# EAGLE design glove5 (EAGLE 7.2.0)
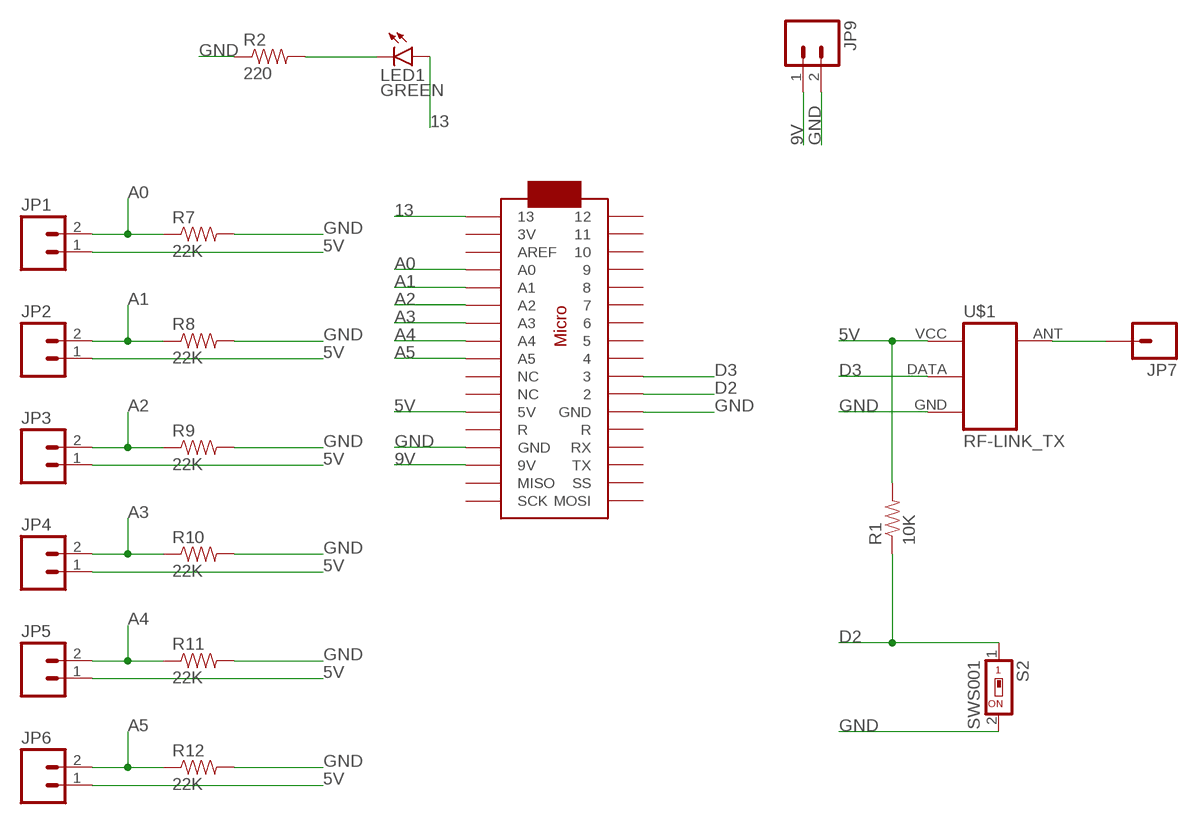
[diagram p0: schematic, sheet 1]

## Parts
JP1  M02LOCK_LONGPADS  [1X02_LOCK_LONGPADS]
JP2  M02LOCK_LONGPADS  [1X02_LOCK_LONGPADS]
JP3  M02LOCK_LONGPADS  [1X02_LOCK_LONGPADS]
JP4  M02LOCK_LONGPADS  [1X02_LOCK_LONGPADS]
JP5  M02LOCK_LONGPADS  [1X02_LOCK_LONGPADS]
JP6  M02LOCK_LONGPADS  [1X02_LOCK_LONGPADS]
JP7  M01PTH_LONGPAD  [1X01_LONGPAD]
JP9  M02LOCK_LONGPADS  [1X02_LOCK_LONGPADS]
LED1  GREEN  LED-FKIT-1206  [FKIT-LED-1206]
R1  10K  RESISTOR1206  [1206]
R2  220  RESISTOR1206  [1206]
R7  22K  RESISTOR1206  [1206]
R8  22K  RESISTOR1206  [1206]
R9  22K  RESISTOR1206  [1206]
R10  22K  RESISTOR1206  [1206]
R11  22K  RESISTOR1206  [1206]
R12  22K  RESISTOR1206  [1206]
S2  SWS001  [SMS-001]
U$1  RF-LINK_TX  [RF-LINK_TX]
U$3  ARDUINOMICRO  [ARDUINOMICRO]

## Nets
5V: JP1.1 JP2.1 JP3.1 JP4.1 JP5.1 JP6.1 R1.2 U$1.VCC(+5V) U$3.P$23(5V)
9V: JP9.1 U$3.P$20(9V)
13: LED1.A U$3.P$34
A0: JP1.2 R7.1 U$3.P$31(A0)
A1: JP2.2 R8.1 U$3.P$30(A1)
A2: JP3.2 R9.1 U$3.P$29(A2)
A3: JP4.2 R10.1 U$3.P$28(A3)
A4: JP5.2 R11.1 U$3.P$27(A4)
A5: JP6.2 R12.1 U$3.P$26(A5)
D2: R1.1 S2.1 U$3.P$11
D3: U$1.DATA U$3.P$10
GND: JP9.2 R2.1 R7.2 R8.2 R9.2 R10.2 R11.2 R12.2 S2.2 U$1.GND U$3.P$12(GND) U$3.P$21(GND)
N$1: JP7.1 U$1.ANT
N$2: LED1.C R2.2
Unconnected: U$3.P$1 U$3.P$2 U$3.P$3 U$3.P$4 U$3.P$5 U$3.P$6 U$3.P$7 U$3.P$8 U$3.P$9 U$3.P$13(R) U$3.P$14(RX) U$3.P$15(TX) U$3.P$16(SS) U$3.P$17(MOSI) U$3.P$18(SCK) U$3.P$19(MISO) U$3.P$22(R) U$3.P$24(NC) U$3.P$25(NC) U$3.P$32(AREF) U$3.P$33(3V)

## Library data of the parts
JP1-JP6 JP9 = SparkFun-Connectors:M02: Standard 2-pin 0.1" header. Use with - straight break away headers ( PRT-00116) - right angle break away headers (PRT-00553) - swiss pins (PRT-00743) - machine pins (PRT-00117) - female headers (PRT-00115) Molex polarized connector foot print use with: PRT-08233 with associated crimp pins and housings. 2.54_SCREWTERM for use with PRT-10571. 3.5mm Screw Terminal footprints for PRT-08084 5mm Screw Terminal footprints for use with PRT-08432
JP7 = SparkFun-Connectors:M01: Header 1 Standard 1-pin 0.1" header. Use with straight break away headers (SKU : PRT-00116), right angle break away headers (PRT-00553), swiss pins (PRT-00743), machine pins (PRT-00117), and female headers (PRT-00115).
LED1 = SparkFun-LED:LED: LEDs Standard schematic elements and footprints for 5mm, 3mm, 1206, and 0603 sized LEDs. 5mm - Spark Fun Electronics SKU : COM-00529 (and others)
R1 R2 R7-R12 = SparkFun-Passives:RESISTOR: Resistor Basic schematic elements and footprints for 0603, 1206, and PTH resistors.
S2 = smd-special:SWS001: SMD Dip Switch 1 pol.
U$1 = SparkFun-RF:RF-LINK_TX: RF Link transmitters WRL-8945, 8946
U$3 = adafruit:ARDUINOMICRO

## Board
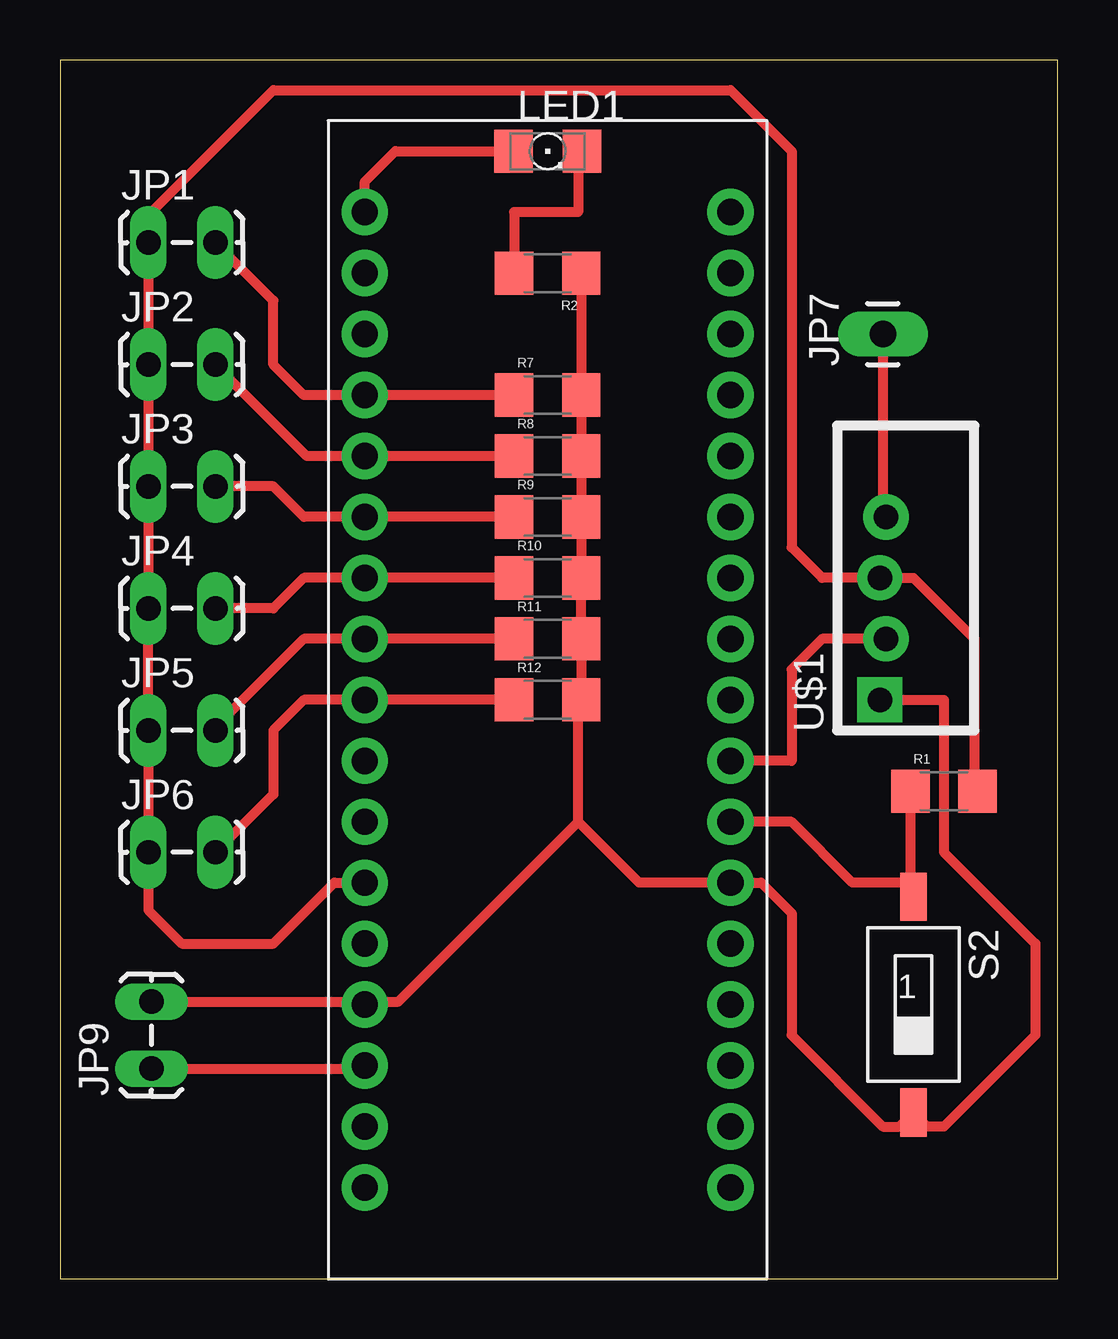
[diagram p1: board, top side]

Size 41.58 x 50.79 mm. Coordinates in mm from the lower left corner, seen from the top.
Outline: 0,0 41.58,0 41.58,50.79 0,50.79 0,0
Copper layers (1*16): Top 0.035mm / dielectric 1.5mm / Bottom 0.035mm
Design rules "default": minimum track width 10mil, minimum drill 24mil, track to track 8mil, track to pad 8mil, pad to pad 8mil, via to via 8mil, smd to smd 8mil, copper to edge 40mil, drill to drill 8mil, minimum pad ring 10mil, minimum via ring 8mil, stop-mask expansion 4mil, vias tented up to drill 0mil, thermal gap 10mil

### Footprints (pad centres in the part's own frame; a part is rotated, then mirrored left to right if it is on the bottom)
1X02_LOCK_LONGPADS = drill 1.016 long: 1 -0.127,0; 2 2.667,0
1X01_LONGPAD = drill 1.118 pad 1.88 long: 1 0,0
FKIT-LED-1206 = smd 1.6 x 1.803: A -1.422,0; C 1.422,0
1206 = smd 1.6 x 1.8: 1 -1.4,0; 2 1.4,0
SMS-001 = smd 1.092 x 2.007: 1 0,-4.496; 2 0,4.496
RF-LINK_TX = drill 1.016 pad 1.88: ANT 7.62,-0.127; DATA 2.54,-0.127; VCC 5.08,0.127 | drill 1.016 pad 1.88 square: GND 0,0.127
ARDUINOMICRO = drill 1.1 pad 1.93: P$1 -20.32,7.62; P$2 -17.78,7.62; P$3 -15.24,7.62; P$4 -12.7,7.62; P$5 -10.16,7.62; P$6 -7.62,7.62; P$7 -5.08,7.62; P$8 -2.54,7.62; P$9 0,7.62; P$10 2.54,7.62; P$11 5.08,7.62; P$12 12.7,-7.62; P$13 10.16,-7.62; P$14 12.7,7.62; P$15 15.24,7.62; P$16 17.78,7.62; P$17 20.32,7.62; P$18 20.32,-7.62; P$19 17.78,-7.62; P$20 15.24,-7.62; P$21 7.62,7.62; P$22 10.16,7.62; P$23 7.62,-7.62; P$24 5.08,-7.62; P$25 2.54,-7.62; P$26 0,-7.62; P$27 -2.54,-7.62; P$28 -5.08,-7.62; P$29 -7.62,-7.62; P$30 -10.16,-7.62; P$31 -12.7,-7.62; P$32 -15.24,-7.62; P$33 -17.78,-7.62; P$34 -20.32,-7.62

### Placement (x,y rotation side)
JP1  3.81,43.18 0 top
JP2  3.81,38.1 0 top
JP3  3.81,33.02 0 top
JP4  3.81,27.94 0 top
JP5  3.81,22.86 0 top
JP6  3.81,17.78 0 top
JP7  34.29,39.37 90 top
JP9  3.81,8.89 90 top
LED1  20.32,46.99 0 top
R1  36.83,20.32 0 top
R2  20.32,41.91 180 top
R7  20.32,36.83 0 top
R8  20.32,34.29 0 top
R9  20.32,31.75 0 top
R10  20.32,29.21 0 top
R11  20.32,26.67 0 top
R12  20.32,24.13 0 top
S2  35.56,11.43 180 top
U$1  34.29,24.13 90 top
U$3  20.32,24.13 270 top

### Tracks (layer width: path | path; a pad name or v marks a point on that pad's centre or on a via)
5V
  Top 0.406: U$3.P$23 11.43,16.51 8.89,13.97 5.08,13.97 3.68,15.37 JP6.1 JP5.1 JP4.1 JP3.1 JP2.1 JP1.1 3.81,43.31 3.81,44.45 8.89,49.53 27.94,49.53 30.48,46.99 30.48,30.48 31.75,29.21 U$1.VCC 35.56,29.21 38.1,26.67 38.1,20.45 R1.2
9V
  Top 0.406: JP9.1 12.57,8.76 U$3.P$20
13
  Top 0.406: U$3.P$34 12.7,45.72 13.97,46.99 LED1.A
A0
  Top 0.406: R7.1 U$3.P$31 10.16,36.83 8.89,38.1 8.89,40.77 JP1.2
A1
  Top 0.406: R8.1 U$3.P$30 10.29,34.29 JP2.2
A2
  Top 0.406: R9.1 U$3.P$29 10.16,31.75 8.89,33.02 JP3.2
A3
  Top 0.406: R10.1 U$3.P$28 10.16,29.21 8.89,27.94 JP4.2
A4
  Top 0.406: R11.1 U$3.P$27 10.16,26.67 6.48,22.99 JP5.2
A5
  Top 0.406: R12.1 U$3.P$26 10.16,24.13 8.89,22.86 8.89,20.19 JP6.2
D2
  Top 0.406: R1.1 35.43,16.06 S2.1 35.56,16.51 33.02,16.51 30.48,19.05 U$3.P$11
D3
  Top 0.406: U$1.DATA 31.75,26.67 30.48,25.4 30.48,21.59 U$3.P$10
GND
  Top 0.406: R2.1 R7.2 R8.2 R9.2 R10.2 R11.2 R12.2 21.59,24 21.59,19.05 | JP9.2 12.57,11.56 | 12.57,11.56 U$3.P$12 | 12.57,11.56 14.1,11.56 21.59,19.05 | U$1.GND 36.83,24.13 36.83,17.78 40.64,13.97 40.64,10.16 36.83,6.35 36.14,6.35 S2.2 34.98,6.35 34.29,6.35 30.48,10.16 30.48,15.24 29.21,16.51 U$3.P$21 24.13,16.51 21.59,19.05
N$1
  Top 0.406: JP7.1 34.29,31.88 U$1.ANT
N$2
  Top 0.406: LED1.C 21.59,46.99 21.59,44.45 18.92,44.45 R2.2